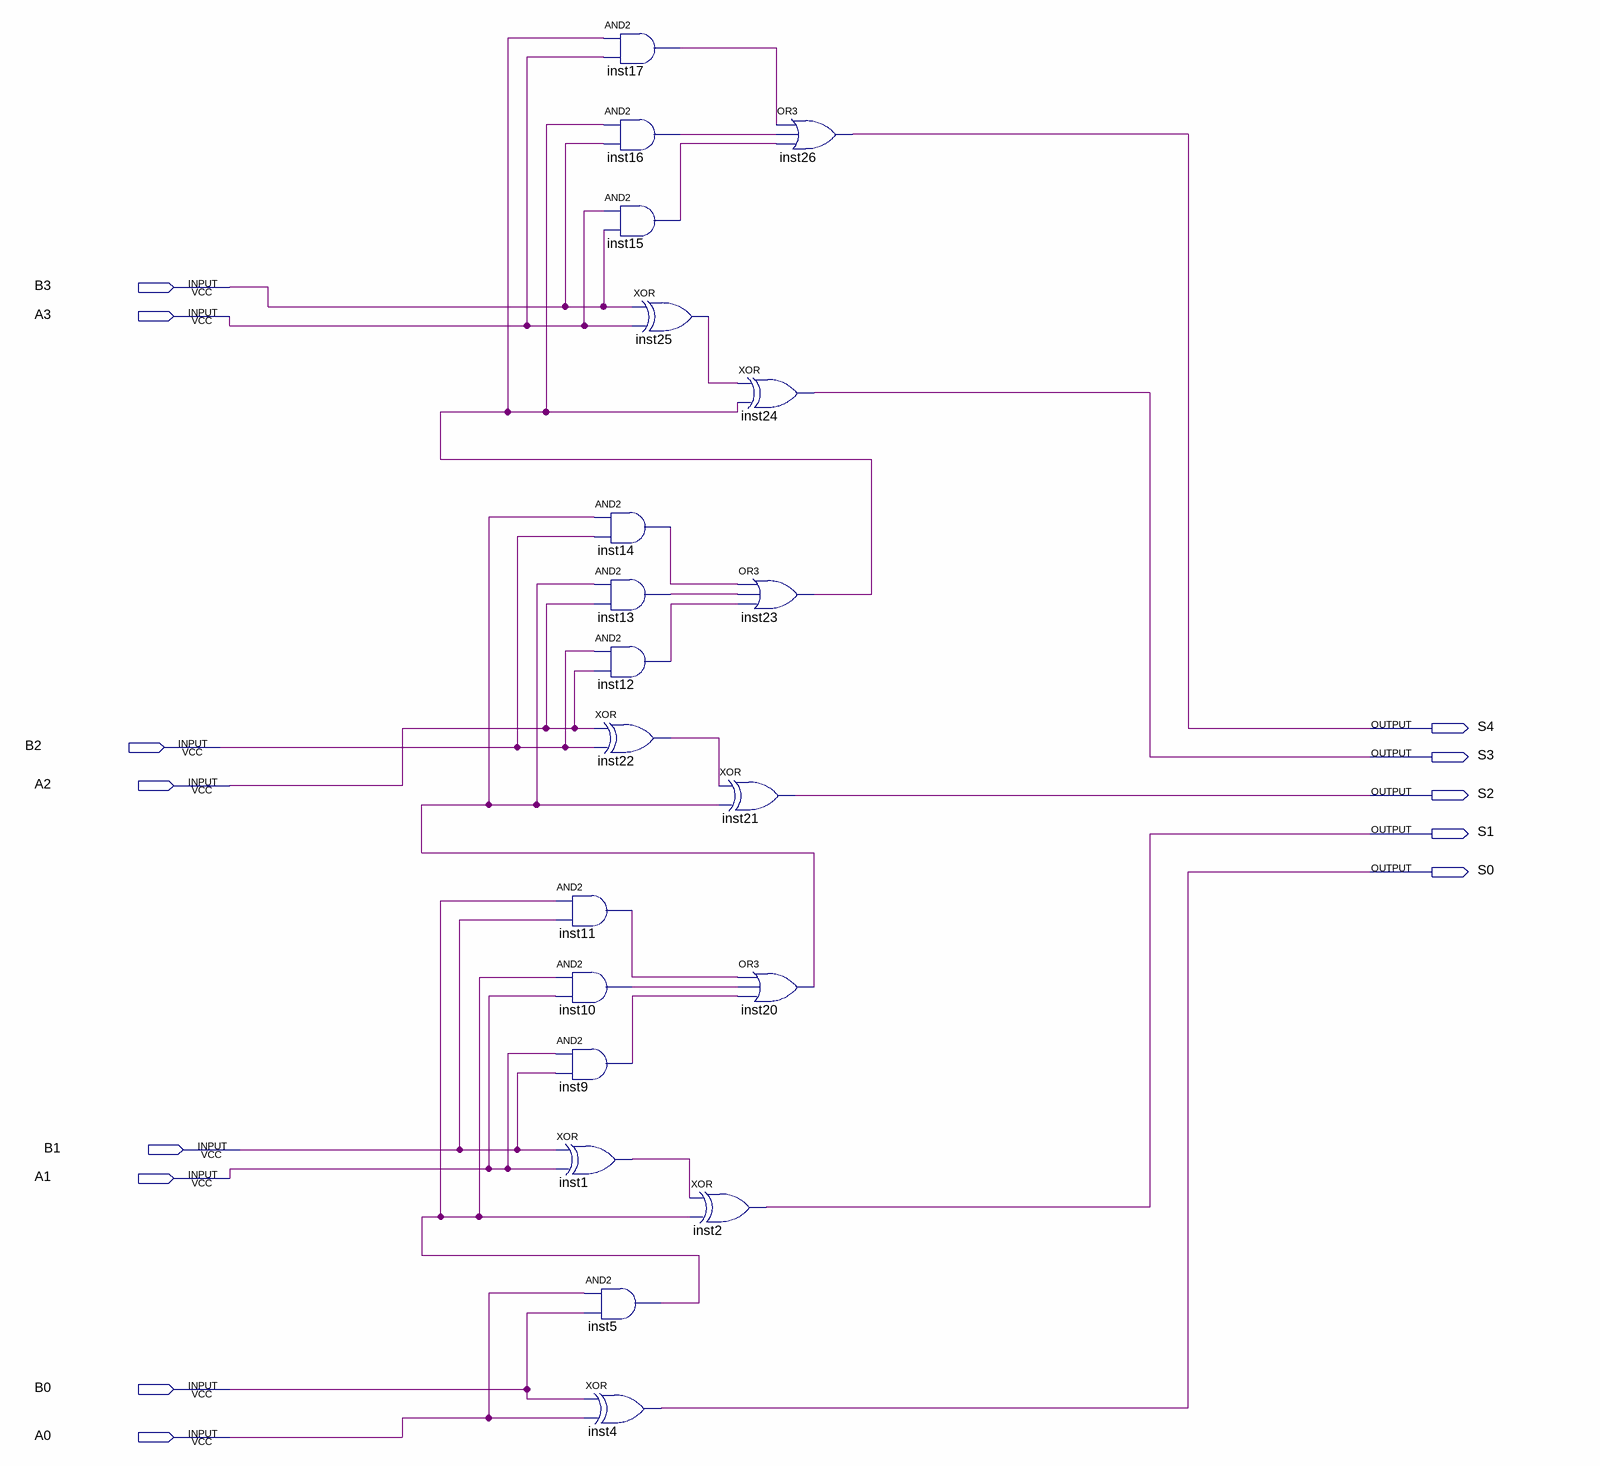
[diagram p0: schematic sheet]
// Quartus schematic Circuito_Somador.bdf as structural Verilog: 20 symbols, 13 pins
module Circuito_Somador (
  input  B3,
  input  A3,
  input  B2,
  input  A2,
  input  B1,
  input  A1,
  input  B0,
  input  A0,
  output S4,
  output S3,
  output S2,
  output S1,
  output S0
);

  wire inst1_out, inst5_out, inst9_out, inst10_out, inst11_out, inst12_out, inst13_out, inst14_out,
       inst15_out, inst16_out, inst17_out, inst20_out, inst22_out, inst23_out, inst25_out;

  and inst11 (inst11_out, inst5_out, B1);
  and inst10 (inst10_out, inst5_out, A1);
  and inst9 (inst9_out, A1, B1);
  xor inst1 (inst1_out, B1, A1);
  and inst17 (inst17_out, inst23_out, A3);
  and inst16 (inst16_out, inst23_out, B3);
  and inst15 (inst15_out, A3, B3);
  xor inst25 (inst25_out, B3, A3);
  and inst14 (inst14_out, inst20_out, B2);
  and inst13 (inst13_out, inst20_out, A2);
  and inst12 (inst12_out, B2, A2);
  xor inst22 (inst22_out, A2, B2);
  and inst5 (inst5_out, A0, B0);
  xor inst4 (S0, B0, A0);
  xor inst2 (S1, inst1_out, inst5_out);
  or inst26 (S4, inst17_out, inst16_out, inst15_out);
  xor inst24 (S3, inst25_out, inst23_out);
  or inst23 (inst23_out, inst14_out, inst13_out, inst12_out);
  xor inst21 (S2, inst22_out, inst20_out);
  or inst20 (inst20_out, inst11_out, inst10_out, inst9_out);
endmodule
